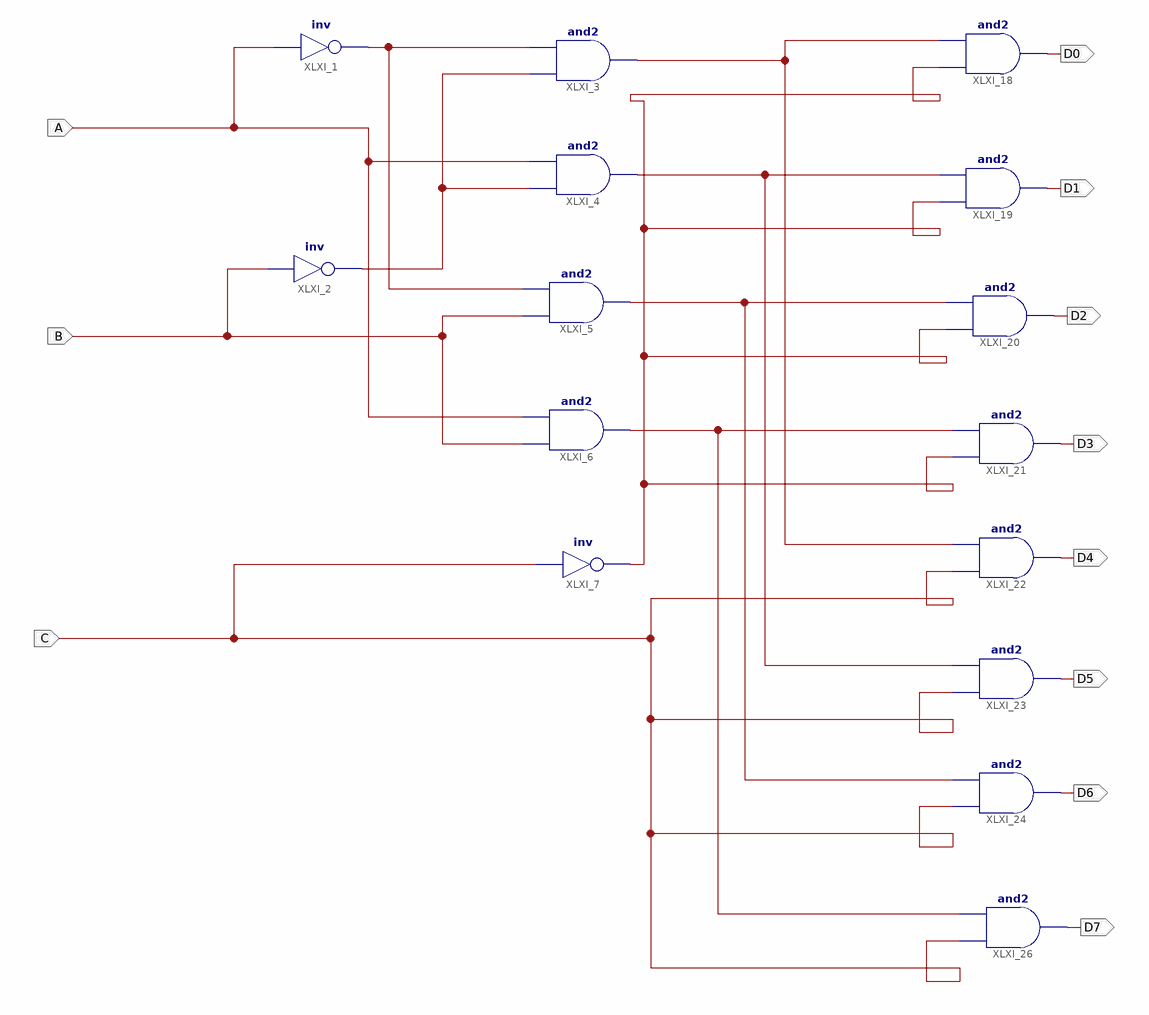
[diagram p0: schematic sheet 1]
// Xilinx ISE schematic D_74LS138.sch (kintex7) as structural Verilog: 15 symbols, 11 ports
module D_74LS138 (
  input  A,
  input  B,
  input  C,
  output D0,
  output D1,
  output D2,
  output D3,
  output D4,
  output D5,
  output D6,
  output D7
);

  wire XLXN_17, XLXN_23, XLXN_27, XLXN_30, XLXN_32, XLXN_35, XLXN_69;

  not XLXI_1 (XLXN_17, A);
  not XLXI_2 (XLXN_23, B);
  and XLXI_3 (XLXN_27, XLXN_23, XLXN_17);
  and XLXI_4 (XLXN_30, XLXN_23, A);
  and XLXI_5 (XLXN_32, B, XLXN_17);
  and XLXI_6 (XLXN_35, B, A);
  not XLXI_7 (XLXN_69, C);
  and XLXI_18 (D0, XLXN_69, XLXN_27);
  and XLXI_19 (D1, XLXN_69, XLXN_30);
  and XLXI_20 (D2, XLXN_69, XLXN_32);
  and XLXI_21 (D3, XLXN_69, XLXN_35);
  and XLXI_22 (D4, C, XLXN_27);
  and XLXI_23 (D5, C, XLXN_30);
  and XLXI_24 (D6, C, XLXN_32);
  and XLXI_26 (D7, C, XLXN_35);
endmodule
